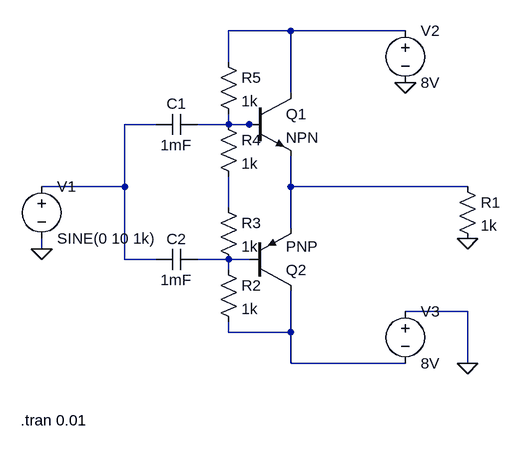
[diagram p0: schematic Draft3.asc]
Draft3.asc, the LTspice schematic file:
Version 4
SHEET 1 880 680
WIRE 240 -32 144 -32
WIRE 416 -32 240 -32
WIRE 144 16 144 -32
WIRE 240 64 240 -32
WIRE 32 112 -16 112
WIRE 144 112 144 96
WIRE 144 112 96 112
WIRE 176 112 144 112
WIRE 192 112 176 112
WIRE -16 208 -16 112
WIRE -16 208 -144 208
WIRE 240 208 240 160
WIRE 512 208 240 208
WIRE 144 240 144 192
WIRE 240 272 240 208
WIRE -144 304 -144 288
WIRE -16 320 -16 208
WIRE 32 320 -16 320
WIRE 144 320 96 320
WIRE 176 320 144 320
WIRE 144 336 144 320
WIRE 512 400 416 400
WIRE 144 432 144 416
WIRE 240 432 240 368
WIRE 240 432 144 432
WIRE 240 480 240 432
WIRE 416 480 240 480
WIRE 512 480 512 400
FLAG 512 288 0
FLAG -144 304 0
FLAG 416 48 0
FLAG 512 480 0
SYMBOL npn 176 64 R0
SYMATTR InstName Q1
SYMBOL res 496 192 R0
SYMATTR InstName R1
SYMATTR Value 1k
SYMBOL voltage -144 192 R0
WINDOW 123 0 0 Left 0
WINDOW 39 0 0 Left 0
SYMATTR InstName V1
SYMATTR Value SINE(0 10 1k)
SYMBOL voltage 416 -48 R0
WINDOW 123 0 0 Left 0
WINDOW 39 0 0 Left 0
SYMATTR InstName V2
SYMATTR Value 8V
SYMBOL res 128 320 R0
SYMATTR InstName R2
SYMATTR Value 1k
SYMBOL res 128 224 R0
SYMATTR InstName R3
SYMATTR Value 1k
SYMBOL res 128 96 R0
SYMATTR InstName R4
SYMATTR Value 1k
SYMBOL res 128 0 R0
SYMATTR InstName R5
SYMATTR Value 1k
SYMBOL pnp 176 368 M180
SYMATTR InstName Q2
SYMBOL cap 32 128 R270
WINDOW 0 32 32 VTop 2
WINDOW 3 0 32 VBottom 2
SYMATTR InstName C1
SYMATTR Value 1mF
SYMBOL cap 32 336 R270
WINDOW 0 32 32 VTop 2
WINDOW 3 0 32 VBottom 2
SYMATTR InstName C2
SYMATTR Value 1mF
SYMBOL voltage 416 384 R0
WINDOW 123 0 0 Left 0
WINDOW 39 0 0 Left 0
SYMATTR InstName V3
SYMATTR Value 8V
TEXT -176 568 Left 2 !.tran 0.01

The netlist it stands for:
* Draft3.asc
Q1 N001 N003 N004 0 NPN
R1 N004 0 1k
V1 N002 0 SINE(0 10 1k)
V2 N001 0 8V
R2 N006 N007 1k
R3 N005 N006 1k
R4 N003 N005 1k
R5 N001 N003 1k
Q2 N007 N006 N004 0 PNP
C1 N002 N003 1mF
C2 N002 N006 1mF
V3 0 N007 8V
.model NPN NPN
.model PNP PNP
.lib standard.bjt
.tran 0.01
.backanno
.end